# EAGLE schematic Home_Control (EAGLE 9.6.2)
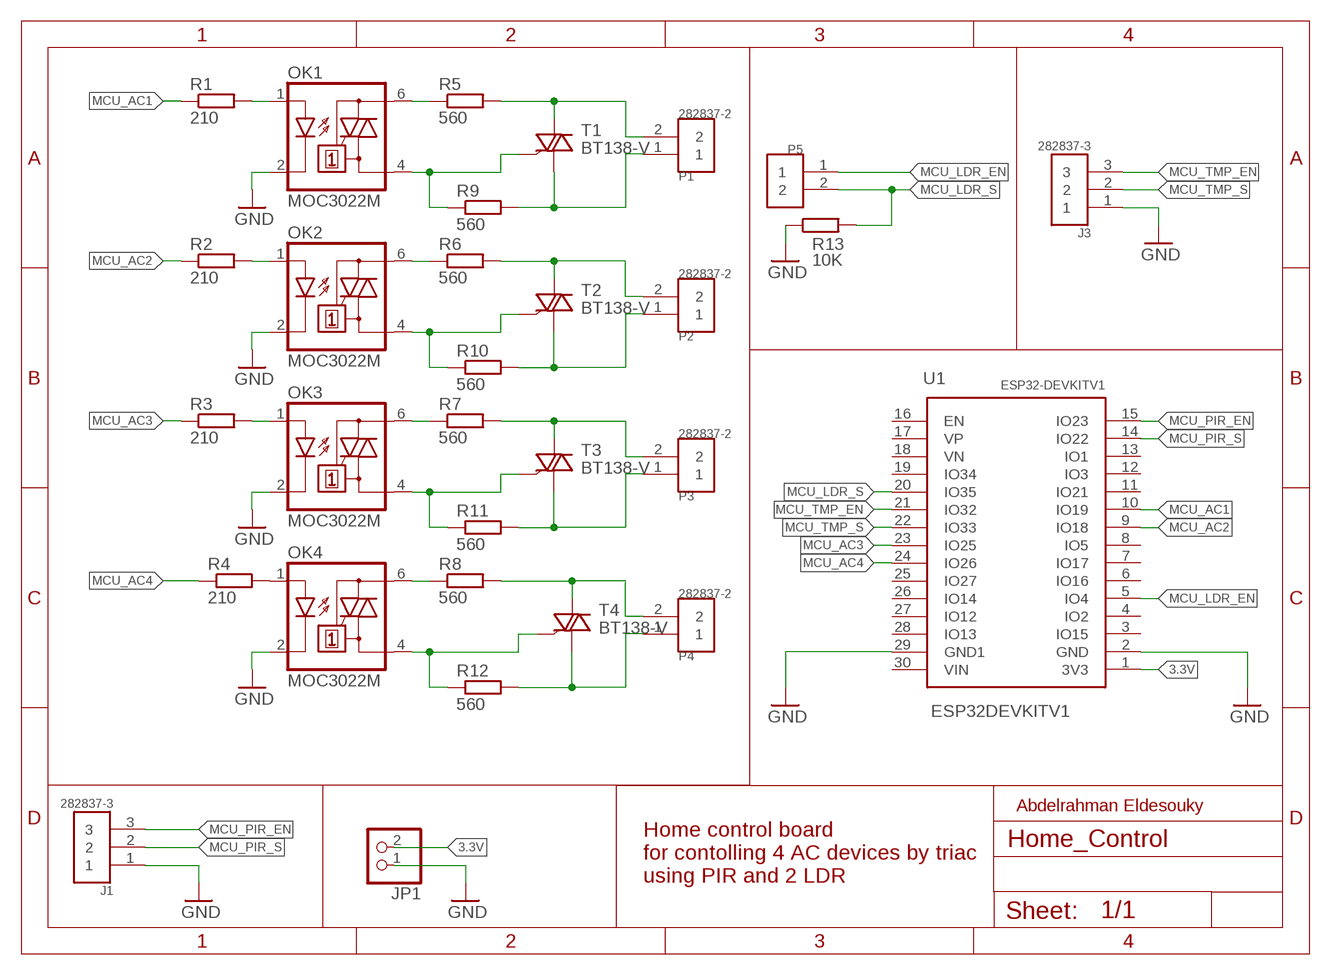
[diagram p0: schematic, sheet 1]

## Parts
J1  282837-3  [TE_282837-3]
J3  282837-3  [TE_282837-3]
JP1  PINHD-1X2  [1X02]
OK1  MOC3022M  [DIL06]
OK2  MOC3022M  [DIL06]
OK3  MOC3022M  [DIL06]
OK4  MOC3022M  [DIL06]
P1  282837-2  [TE_282837-2]
P2  282837-2  [TE_282837-2]
P3  282837-2  [TE_282837-2]
P4  282837-2  [TE_282837-2]
P5  282837-2  [TE_282837-2]
R1  210  R-EU_0411/15  [0411/15]
R2  210  R-EU_0411/15  [0411/15]
R3  210  R-EU_0411/15  [0411/15]
R4  210  R-EU_0411/15  [0411/15]
R5  560  R-EU_0411/15  [0411/15]
R6  560  R-EU_0411/15  [0411/15]
R7  560  R-EU_0411/15  [0411/15]
R8  560  R-EU_0411/15  [0411/15]
R9  560  R-EU_0411/15  [0411/15]
R10  560  R-EU_0411/15  [0411/15]
R11  560  R-EU_0411/15  [0411/15]
R12  560  R-EU_0411/15  [0411/15]
R13  10K  R-EU_0411/15  [0411/15]
T1  BT138-V  [TO220BV]
T2  BT138-V  [TO220BV]
T3  BT138-V  [TO220BV]
T4  BT138-V  [TO220BV]
U1  ESP32DEVKITV1  [ESP32-DEVKITV1]

## Nets
3.3V: JP1.2 U1.1(3V3)
GND: J1.1 J3.1 JP1.1 OK1.2(C) OK2.2(C) OK3.2(C) OK4.2(C) R13.1 U1.2(GND) U1.29(GND1)
MCU_AC1: R1.1 U1.10(IO19)
MCU_AC2: R2.1 U1.9(IO18)
MCU_AC3: R3.1 U1.23(IO25)
MCU_AC4: R4.1 U1.24(IO26)
MCU_LDR_EN: P5.1 U1.5(IO4)
MCU_LDR_S: P5.2 R13.2 U1.20(IO35)
MCU_PIR_EN: J1.3 U1.15(IO23)
MCU_PIR_S: J1.2 U1.14(IO22)
MCU_TMP_EN: J3.3 U1.21(IO32)
MCU_TMP_S: J3.2 U1.22(IO33)
N$1: OK1.1(A) R1.2
N$2: OK2.1(A) R2.2
N$3: OK3.1(A) R3.2
N$4: OK4.1(A) R4.2
N$5: OK1.4(A1) R9.1 T1.G
N$6: OK2.4(A1) R10.1 T2.G
N$7: OK3.4(A1) R11.1 T3.G
N$8: OK4.4(A1) R12.1 T4.G
N$9: OK1.6(A2) R5.1
N$10: P1.2 R5.2 T1.T2(A2)
N$11: OK2.6(A2) R6.1
N$12: P2.2 R6.2 T2.T2(A2)
N$13: OK3.6(A2) R7.1
N$14: P3.2 R7.2 T3.T2(A2)
N$15: OK4.6(A2) R8.1
N$16: P4.2 R8.2 T4.T2(A2)
N$17: P1.1 R9.2 T1.T1(A1)
N$19: P2.1 R10.2 T2.T1(A1)
N$21: P3.1 R11.2 T3.T1(A1)
N$23: P4.1 R12.2 T4.T1(A1)
Unconnected: U1.3(IO15) U1.4(IO2) U1.6(IO16) U1.7(IO17) U1.8(IO5) U1.11(IO21) U1.12(IO3) U1.13(IO1) U1.16(EN) U1.17(VP) U1.18(VN) U1.19(IO34) U1.25(IO27) U1.26(IO14) U1.27(IO12) U1.28(IO13) U1.30(VIN)

## Notes on the sheet
- Abdelrahman Eldesouky
- Home control board 
  for contolling 4 AC devices by triac
  using PIR and 2 LDR

## Library data of the parts
J1 J3 = 282837-3:282837-3: TERMI-BLOK PCB MOUNT 3P Check availability <https://pricing.snapeda.com/parts/282837-3/TE%20Connectivity/view-part?ref=eda>; AVAILABILITY: In Stock; COMMENT: 282837-3; DESCRIPTION: Wire to Board 3 Position 5.08 mm Pitch 30-16 AWG Euro Style Terminal Block; MF: TE Connectivity; MP: 282837-3; PACKAGE: None; PRICE: None; PURCHASE-URL: https://pricing.snapeda.com/search/part/282837-3/?ref=eda
JP1 = pinhead:PINHD-1X2: PIN HEADER
OK1-OK4 = optocoupler:MOC30*M: RANDOM-PHASE OPTOISOLATORS TRIAC DRIVER OUTPUT Source: http://www.fairchildsemi.com MOC3020-M.pdf; MF: FAIRCHILD SEMICONDUCTOR; MPN: MOC3022-M; OC_FARNELL: 1021086; OC_NEWARK: 58K1956
P1-P5 = 282837-2:282837-2: TERM BLOCK 5.08MM 2POS SIDE ENTY Check availability <https://pricing.snapeda.com/parts/282837-2/TE%20Connectivity/view-part?ref=eda>; AVAILABILITY: In Stock; COMMENT: 282837-2; DESCRIPTION: Connector Terminal Blocks Receptacle 2 Position 5.08mm Solder Straight Thru-Hole 13.5A/Contact; EU_ROHS_COMPLIANCE: Compliant with Exemptions; MF: TE Connectivity; MP: 282837-2; PACKAGE: None; PRICE: None; PURCHASE-URL: https://pricing.snapeda.com/search/part/282837-2/?ref=eda
R1-R13 = rcl:R-EU_: RESISTOR, European symbol; SPICEPREFIX: R
T1-T4 = triac:BT138: TRIAC Source: http://www.semiconductors.philips.com BT138_SERIES_2.pdf
U1 = ESP32-DEVKITV1:ESP32DEVKITV1